# EAGLE design Lab6 (EAGLE 7.0.0)
Lab 6 Jonathan Valvano, system implementing Lab 3, 4 or 5 on the LM3S811.
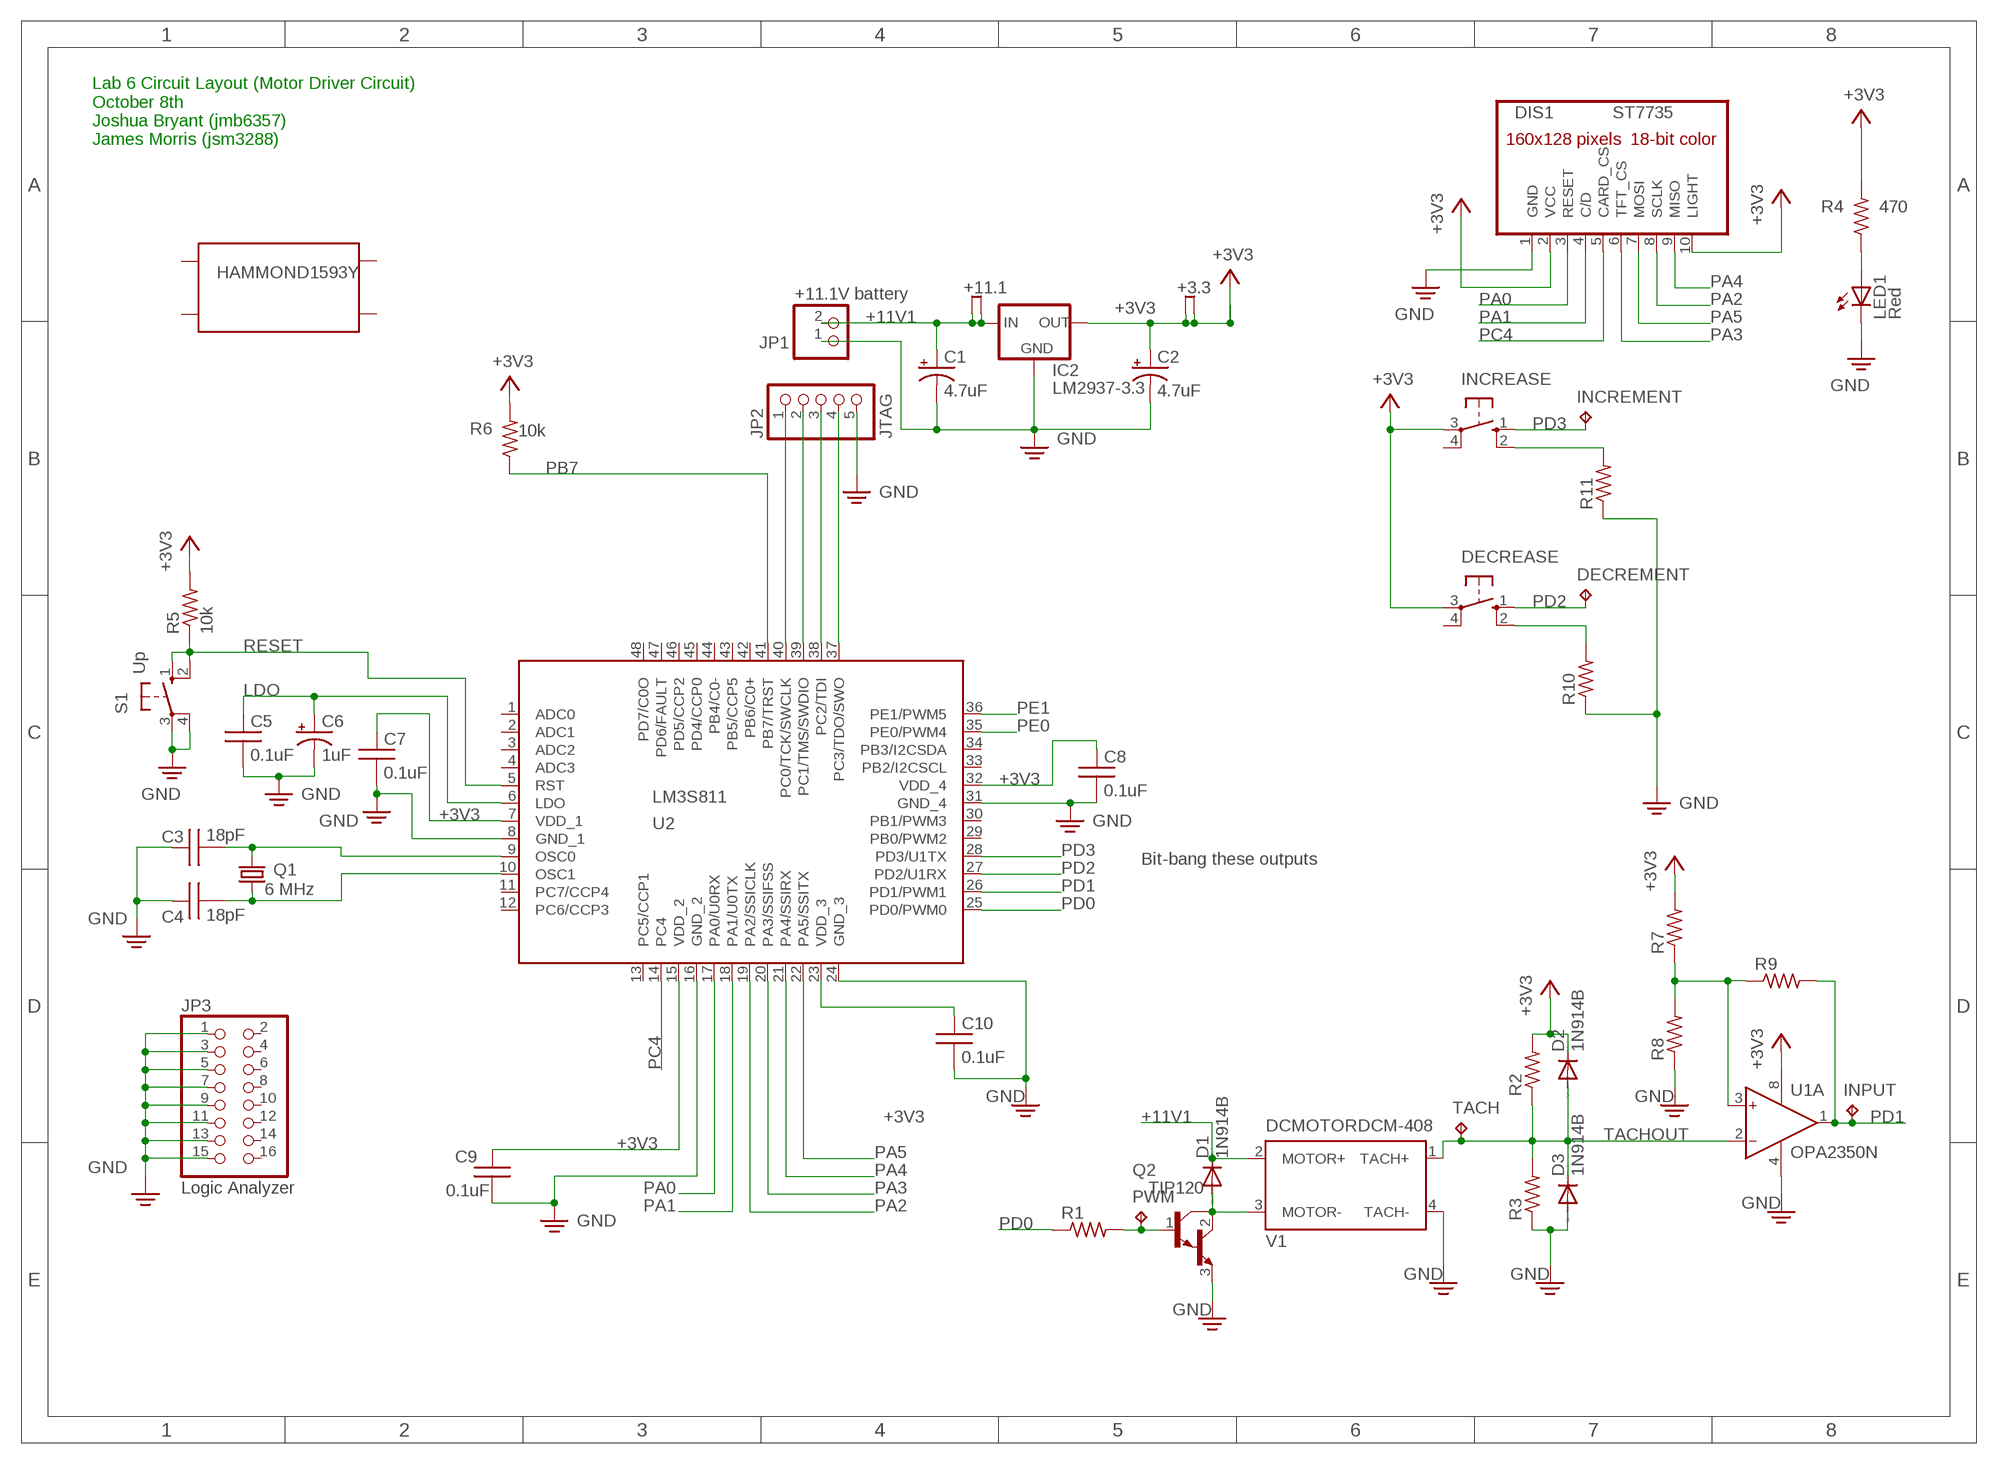
[diagram p0: schematic, sheet 1]

## Parts
+3.3  TP2  [TP2]
+11.1  TP2  [TP2]
C1  4.7uF  CAPACITOR_POLARIZEDE5-6  [CAP200MILPOLARIZED]
C2  4.7uF  CAPACITOR_POLARIZEDE5-6  [CAP200MILPOLARIZED]
C3  18pF  CAPACITOR025-024X044  [CAP100MIL]
C4  18pF  CAPACITOR025-024X044  [CAP100MIL]
C5  0.1uF  CAPACITOR025-024X044  [CAP100MIL]
C6  1uF  CAPACITOR_POLARIZEDE5-6  [CAP200MILPOLARIZED]
C7  0.1uF  CAPACITOR025-024X044  [CAP100MIL]
C8  0.1uF  CAPACITOR025-024X044  [CAP100MIL]
C9  0.1uF  CAPACITOR025-024X044  [CAP100MIL]
C10  0.1uF  CAPACITOR025-024X044  [CAP100MIL]
D1  1N914B  [DO35-7]
D2  1N914B  [DO35-7]
D3  1N914B  [DO35-7]
DECREASE  B3F-1052  [B3F-10XX]
DECREMENT  TP_KEYSTONE500X  [P1.1MM]
DIS1  ST7735  [ST7735]
IC2  LM2937-3.3  78XXS  [78XXS]
INCREASE  B3F-1052  [B3F-10XX]
INCREMENT  TP_KEYSTONE500X  [P1.1MM]
INPUT  TP_KEYSTONE500X  [P1.1MM]
JP1  +11.1V battery  PINHD-1X2  [1X02]
JP2  JTAG  PINHD-1X5  [1X05]
JP3  Logic Analyzer  PINHD-2X8/90  [2X08/90]
LED1  Red  LED5MM  [LED5MM]
PWM  TP_KEYSTONE500X  [P1.1MM]
Q1  6 MHz  CRYSTALHC49S  [HC49/S]
Q2  TIP120  [TO220]
R1  RESISTOR0204/7  [RES300MIL]
R2  RESISTOR0204/7  [RES300MIL]
R3  RESISTOR0204/7  [RES300MIL]
R4  470  RESISTOR0204/5  [RES200MIL]
R5  10k  RESISTOR0204/5  [RES200MIL]
R6  10k  RESISTOR0204/5  [RES200MIL]
R7  RESISTOR0204/7  [RES300MIL]
R8  RESISTOR0204/7  [RES300MIL]
R9  RESISTOR0204/7  [RES300MIL]
R10  RESISTOR0204/7  [RES300MIL]
R11  RESISTOR0204/7  [RES300MIL]
S1  Up  B3F-1052  [B3F-10XX]
TACH  TP_KEYSTONE500X  [P1.1MM]
U1  OPA2350N  [DIL08]
U2  LM3S811  [LQFP48-7X7]
U$1  HAMMOND1593Y  [HAMMOND1593Y]
V1  DCMOTORDCM-408  [DCMOTOR]

## Nets
+3V3: +3.3.MP1(TPB) +3.3.MP(TPA) C2.+ C7.1 C8.1 C9.1 C10.1 D2.C DECREASE.3(P) DIS1.2(VCC) DIS1.10(LIGHT) IC2.OUT INCREASE.3(P) R2.2 R4.2 R5.2 R6.2 R7.2 U1.8(P:V+) U2.7(VDD_1) U2.15(VDD_2) U2.23(VDD_3) U2.32(VDD_4)
+11V1: +11.1.MP1(TPB) +11.1.MP(TPA) C1.+ D1.C IC2.IN JP1.2 V1.2(MOTOR+)
GND: C1.- C2.- C3.1 C4.1 C5.2 C6.- C7.2 C8.2 C9.2 C10.2 D3.A DIS1.1(GND) IC2.GND JP1.1 JP2.5 JP3.1 JP3.3 JP3.5 JP3.7 JP3.9 JP3.11 JP3.13 JP3.15 LED1.K(C) Q2.3(E) R3.1 R8.1 R10.1 R11.1 S1.3(P) S1.4(P1) U1.4(P:V-) U2.8(GND_1) U2.16(GND_2) U2.24(GND_3) U2.31(GND_4) V1.4(TACH-)
LDO: C5.1 C6.+ U2.6(LDO)
M-: D1.A Q2.2(C) V1.3(MOTOR-)
N$1: JP2.4 U2.37(PC3/TDO/SWO)
N$2: JP2.3 U2.38(PC2/TDI)
N$3: JP2.2 U2.39(PC1/TMS/SWDIO)
N$4: JP2.1 U2.40(PC0/TCK/SWCLK)
N$6: PWM.TP Q2.1(B) R1.2
N$8: INCREASE.2(S1) R11.2
N$10: DECREASE.2(S1) R10.2
N$15: R7.1 R8.2 R9.1 U1.3(A:IN+)
OSC0: C3.2 Q1.2 U2.9(OSC0)
OSC1: C4.2 Q1.1 U2.10(OSC1)
PA0: DIS1.3(RESET) U2.17(PA0/U0RX)
PA1: DIS1.4(C/D) U2.18(PA1/U0TX)
PA2: DIS1.8(SCLK) U2.19(PA2/SSICLK)
PA3: DIS1.6(TFT_CS) U2.20(PA3/SSIFSS)
PA4: DIS1.9(MISO) U2.21(PA4/SSIRX)
PA5: DIS1.7(MOSI) U2.22(PA5/SSITX)
PB7: R6.1 U2.41(PB7/TRST)
PC4: DIS1.5(CARD_CS) U2.14(PC4)
PD0: R1.1 U2.25(PD0/PWM0)
PD1: INPUT.TP R9.2 U1.1(A:OUT) U2.26(PD1/PWM1)
PD2: DECREASE.1(S) DECREMENT.TP U2.27(PD2/U1RX)
PD3: INCREASE.1(S) INCREMENT.TP U2.28(PD3/U1TX)
PE0: U2.35(PE0/PWM4)
PE1: U2.36(PE1/PWM5)
RESET: R5.1 S1.1(S) S1.2(S1) U2.5(RST)
TACHOUT: D2.A D3.C R2.1 R3.2 TACH.TP U1.2(A:IN-) V1.1(TACH+)
VLED: LED1.A R4.1
Unconnected: DECREASE.4(P1) INCREASE.4(P1) JP3.2 JP3.4 JP3.6 JP3.8 JP3.10 JP3.12 JP3.14 JP3.16 U1.5(B:IN+) U1.6(B:IN-) U1.7(B:OUT) U2.1(ADC0) U2.2(ADC1) U2.3(ADC2) U2.4(ADC3) U2.11(PC7/CCP4) U2.12(PC6/CCP3) U2.13(PC5/CCP1) U2.29(PB0/PWM2) U2.30(PB1/PWM3) U2.33(PB2/I2CSCL) U2.34(PB3/I2CSDA) U2.42(PB6/C0+) U2.43(PB5/CCP5) U2.44(PB4/C0-) U2.45(PD4/CCP0) U2.46(PD5/CCP2) U2.47(PD6/FAULT) U2.48(PD7/C0O) U$1.1(H0) U$1.2(H1) U$1.3(H2) U$1.4(H3)

## Notes on the sheet
- Lab 6 Circuit Layout (Motor Driver Circuit)
  October 8th
  Joshua Bryant (jmb6357)
  James Morris (jsm3288)
- Bit-bang these outputs

## Library data of the parts
+3.3 +11.1 = EE445L:TP2: Low-cost test point Made with two 0.8mm holes.
C1 C2 C6 = EE445L:CAPACITOR_POLARIZED: POLARIZED CAPACITOR, American symbol
C3-C5 C7-C10 = EE445L:CAPACITOR: CAPACITOR, American symbol
D1-D3 = EE445L:1N914: DIODE high speed (Philips) 1N914
DECREASE INCREASE S1 = EE445L:B3F-1052: OMRON SWITCH 1.1mm holes; MPN: B3F-1000; OC_FARNELL: 176432; OC_NEWARK: 36M3542
DECREMENT INCREMENT INPUT PWM TACH = EE445L:TP: Test pad Test point, black, Keystone Electronics 5001, Digikey 5001K-ND Test point, orange, Keystone Electronics 5003, Digikey 5003K-ND Test point, yellow, Keystone Electronics 5004, Digikey 5004K-ND Test point, white, Keystone Electronics 5002, Digikey 5002K-ND Test point, red, Keystone Electronics 5000, Digikey 5000K-ND
DIS1 = EE445L:ST7735: Sitronix ST7735R 18-bit color, 1.8" TFT LCD display, 128*160, http://www.adafruit.com/products/358 // Backlight (pin 10) connected to +3.3 V // MISO (pin 9) PA4 (SSI0Rx) // SCK (pin 8) connected to PA2 (SSI0Clk) // MOSI (pin 7) connected to PA5 (SSI0Tx) // TFT_CS (pin 6) connected to PA3 (SSI0Fss) // CARD_CS (pin 5) connected to PD7 GPIO output(for SDC) // Data/Command (pin 4) connected to PA6 (GPIO), high for data, low for command // RESET (pin 3) connected to PA7 (GPIO) // VCC (pin 2) connected to +3.3 V // Gnd (pin 1) connected to ground; OC_FARNELL: unknown; OC_NEWARK: unknown
IC2 = EE445L:78XXS: VOLTAGE REGULATOR 7805, 78M05, LM2937-5.0, LM2937-3.3
JP1 = EE445L:PINHD-1X2: PIN HEADER
JP2 = EE445L:PINHD-1X5: PIN HEADER
JP3 = EE445L:PINHD-2X8: PIN HEADER
LED1 = EE445L:LED: Avago Technologies LED Green 2mA 5mm diffused, HLMP-4740, Digikey 516-1327-ND Red 1.6V 1mA 5mm diffused, HLMP-D150, Digikey 516-1323-ND Yellow 2mA 5mm diffused, HLMP-4719, Digikey 516-1326-ND Orange 10mA 5mm diffused HLMP-D401, Digikey 516-1330-ND Blue 10mA 5mm diffused
Q1 = EE445L:CRYSTAL: CRYSTAL HC49/US; OC_FARNELL: 1667008; OC_NEWARK: unknown
Q2 = EE445L:TIP120: NPN Darlington Transistor
R1-R11 = EE445L:RESISTOR: RESISTOR, American symbol
U1 = EE445L:OPA2350: 2.7V to 5.5V Rail-to-Rail I/O Dual Amplifier High-Speed 38MHz, Single-Supply, slew rate 22V/us, 500uV offset, 4uV noise; OC_FARNELL: unknown; OC_NEWARK: unknown
U2 = EE445L:LM3S811: LM3S811-IQN50-C28k RAM,64k Flash,32 I/O pins, 50 MHz, Cortex M3 PA0 – PA1 U0RX, U0TX Universal Asynchronous Receiver/Transmitter, UART0 PA2 – PA5 SCLK, SFSS, SRX, STX Synchronous Serial Interface, SSI0 PB0, PB1 PWM2, PWM3 Pulse Width Modulator 1 PB2 – PB3 SCL, SDA Inter-Integrated Circuit, I2C0 PB4, PB6, PD7 C0-, C0+, C0o Analog Comparator 0 PB5 CCP5 Timer2B Capture/Compare PB7, PC0 – PC3 TRST, TCLK, TMS, TDI, TDO JTAG Debugger PC5 CCP1 Timer 0B Capture/Compare PC6 CCP3 Timer 1B Capture/Compare PC7 CCP4 Timer 2A Capture/Compare PD0, PD1 PWM0, PWM1 Pulse Width Modulator 0 PD2 – PD3 U1RX, U1TX Universal Asynchronous Receiver/Transmitter, UART1 PD4 CCP0 Timer 0A Capture/Compare PD5 CCP2 Timer 1A Capture/Compare PD6 Fault Hold all PWM outputs in safe state PE0, PE1 PWM4, PWM5 Pulse Width Modulator 2 ADC3-ADC0 ADC 10 bit ADC; MFN: LM3S811-IQN50-C2
U$1 = EE445L:HAMMOND1593Y: Hammond 1593Y 5.5 by 2.6 by 1.1 box PCB for this box, with drill holes Newark 95B0648 $ 5.90 (element14) Mouser 1593YBK $ 4.80 Digi-Key HM862-ND $4.82
V1 = EE445L:DCMOTOR: DC motor DC motor with tachometer, www.allelectronics.com CAT# DCM-408. The two wires located near the shaft are the brushed DC motor, and the two wires going under the plastic cap are the tachometer. Pin 1, yellow, motor+ Pin 2, red, tach + Pin 3, blue, tach - Pin 4, green, motor -; OC_FARNELL: unknown; OC_NEWARK: unknown

## Board
Lab 6 Jonathan Valvano, system implementing Lab 3, 4 or 5 on the LM3S811.
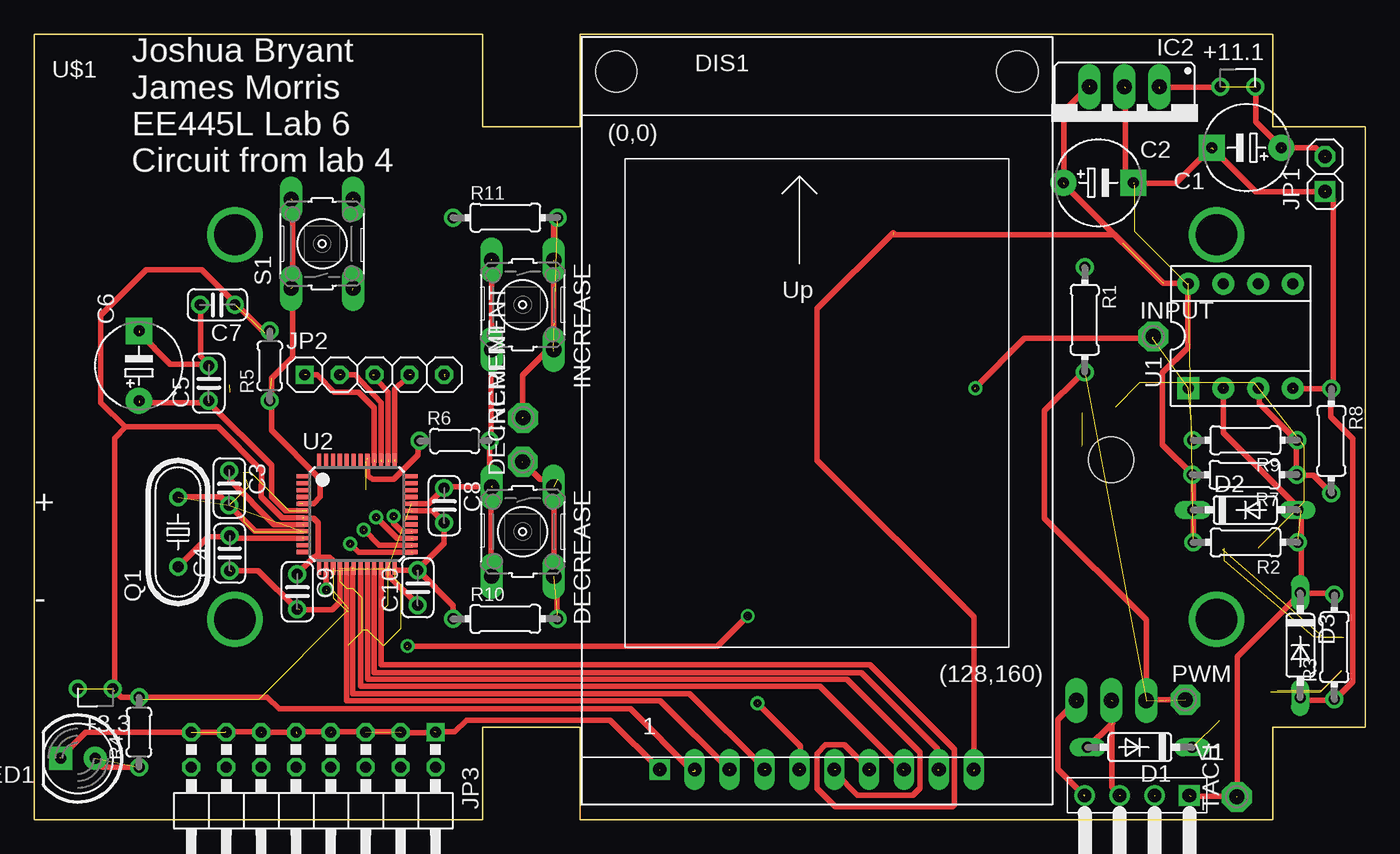
[diagram p1: board, top side]
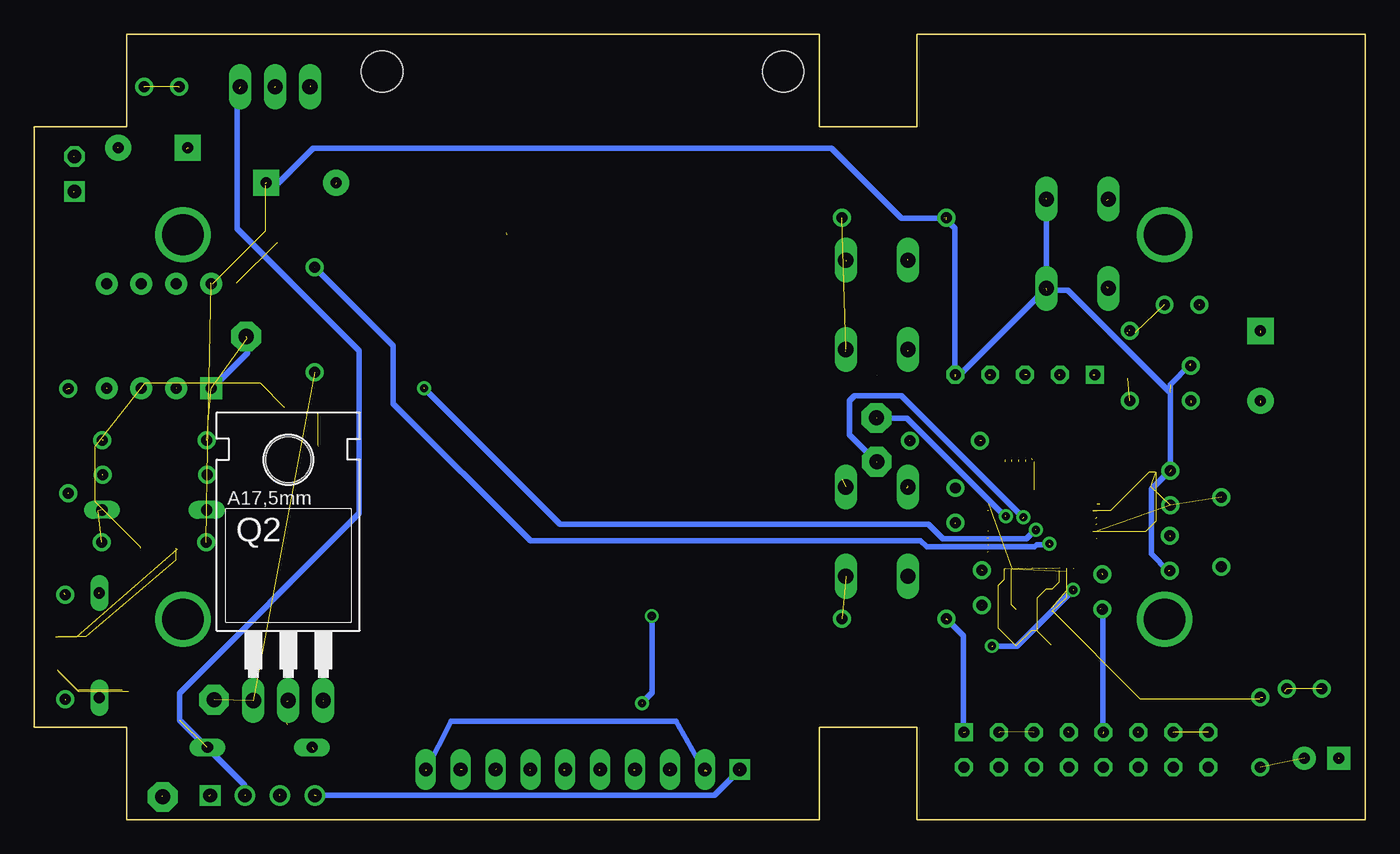
[diagram p2: board, bottom side, seen from below]

Size 96.9 x 57.15 mm. Coordinates in mm from the lower left corner, seen from the top.
Copper layers (1*16): Top 0.035mm / dielectric 1.5mm / Bottom 0.035mm
Design rules "default *": minimum track width 10mil, minimum drill 0.8mm, track to track 8mil, track to pad 8mil, pad to pad 8mil, via to via 8mil, smd to smd 8mil, copper to edge 40mil, drill to drill 8mil, minimum pad ring 10mil, minimum via ring 8mil, stop-mask expansion 4mil, vias tented up to drill 0mil, thermal gap 10mil

### Footprints (pad centres in the part's own frame; a part is rotated, then mirrored left to right if it is on the bottom)
TP2 = drill 0.8: MP 0,0; MP1 2.54,0
CAP200MILPOLARIZED = drill 0.8 pad 1.905: + -2.54,0 | drill 0.8 pad 1.905 square: - 2.54,0
CAP100MIL = drill 0.8: 1 -1.27,0; 2 1.27,0
DO35-7 = drill 0.813 long: A 3.81,0; C -3.81,0
B3F-10XX = drill 1.1 long: 1 -3.251,2.261; 2 3.251,2.261; 3 -3.251,-2.261; 4 3.251,-2.261
P1.1MM = drill 1.1 pad 2.159 octagon: TP 0,0
ST7735 = drill 1 square: 1 -10.16,-30.48 | drill 1 long: 2 -7.62,-30.48; 3 -5.08,-30.48; 4 -2.54,-30.48; 5 0,-30.48; 6 2.54,-30.48; 7 5.08,-30.48; 8 7.62,-30.48; 9 10.16,-30.48; 10 12.7,-30.48 | hole 3: -13.335,20.32; 15.875,20.32
78XXS = drill 1.1 long: GND 0,-2.54; IN -2.54,-2.54; OUT 2.54,-2.54
1X02 = drill 1 square: 1 -1.27,0 | drill 1 octagon: 2 1.27,0
1X05 = drill 0.8 square: 1 -5.08,0 | drill 0.8 octagon: 2 -2.54,0; 3 0,0; 4 2.54,0; 5 5.08,0
2X08/90 = drill 0.8 square: 1 -8.89,-6.35 | drill 0.8 octagon: 2 -8.89,-3.81; 3 -6.35,-6.35; 4 -6.35,-3.81; 5 -3.81,-6.35; 6 -3.81,-3.81; 7 -1.27,-6.35; 8 -1.27,-3.81; 9 1.27,-6.35; 10 1.27,-3.81; 11 3.81,-6.35; 12 3.81,-3.81; 13 6.35,-6.35; 14 6.35,-3.81; 15 8.89,-6.35; 16 8.89,-3.81
LED5MM = drill 0.8 pad 1.676: A -1.27,0 | drill 0.8 pad 1.676 square: K 1.27,0
HC49/S = drill 0.8: 1 -2.54,0; 2 2.54,0
TO220 = drill 1.1 long: 1 -2.54,-6.35; 2 0,-6.35; 3 2.54,-6.35 | hole 3.302: 0,11.176
RES300MIL = drill 0.8: 1 -3.81,0; 2 3.81,0
RES200MIL = drill 0.8: 1 -2.54,0; 2 2.54,0
DIL08 = drill 0.8 pad 1.6 square: 1 -3.81,-3.81 | drill 0.8 pad 1.6: 2 -1.27,-3.81; 3 1.27,-3.81; 4 3.81,-3.81; 5 3.81,3.81; 6 1.27,3.81; 7 -1.27,3.81; 8 -3.81,3.81
LQFP48-7X7 = smd 0.9 x 0.3: 1 -3.95,2.75; 2 -3.95,2.25; 3 -3.95,1.75; 4 -3.95,1.25; 5 -3.95,0.75; 6 -3.95,0.25; 7 -3.95,-0.25; 8 -3.95,-0.75; 9 -3.95,-1.25; 10 -3.95,-1.75; 11 -3.95,-2.25; 12 -3.95,-2.75; 25 3.95,-2.75; 26 3.95,-2.25; 27 3.95,-1.75; 28 3.95,-1.25; 29 3.95,-0.75; 30 3.95,-0.25; 31 3.95,0.25; 32 3.95,0.75; 33 3.95,1.25; 34 3.95,1.75; 35 3.95,2.25; 36 3.95,2.75 | smd 0.3 x 0.9: 13 -2.75,-3.95; 14 -2.25,-3.95; 15 -1.75,-3.95; 16 -1.25,-3.95; 17 -0.75,-3.95; 18 -0.25,-3.95; 19 0.25,-3.95; 20 0.75,-3.95; 21 1.25,-3.95; 22 1.75,-3.95; 23 2.25,-3.95; 24 2.75,-3.95; 37 2.75,3.95; 38 2.25,3.95; 39 1.75,3.95; 40 1.25,3.95; 41 0.75,3.95; 42 0.25,3.95; 43 -0.25,3.95; 44 -0.75,3.95; 45 -1.25,3.95; 46 -1.75,3.95; 47 -2.25,3.95; 48 -2.75,3.95
HAMMOND1593Y = drill 3: 1 -33.655,13.995; 2 -33.655,-13.995; 3 37.821,-13.995; 4 37.821,13.995
DCMOTOR = drill 1 square: 1 -3.81,0 | drill 1: 2 -1.27,0; 3 1.27,0; 4 3.81,0

### Placement (x,y rotation side)
+3.3  5.71,9.53 180 top
+11.1  86.36,53.34 0 top
C1  88.26,48.89 180 top
C2  77.47,46.36 0 top
C3  14.2,24.13 270 top
C4  14.22,19.38 90 top
C5  12.7,31.75 90 top
C6  7.62,33.02 90 top
C7  13.33,37.47 180 top
C8  29.84,22.86 270 top
C9  19.15,16.59 270 top
C10  27.91,16.87 90 top
D1  80.49,5.26 180 top
D2  88.16,22.53 0 top
D3  92.18,12.67 270 top
DECREASE  35.56,20.96 270 top
DECREMENT  35.56,26.04 90 top
DIS1  55.7,34.11 0 top
IC2  79.38,50.8 180 top
INCREASE  35.56,37.47 270 top
INCREMENT  35.59,29.24 90 top
INPUT  81.48,35.15 0 top
JP1  93.98,46.99 90 top
JP2  24.76,32.39 0 top
JP3  20.32,0 180 top
LED1  3.17,4.45 180 top
PWM  83.82,8.71 0 top
Q1  10.46,20.93 90 top
Q2  78.41,15.01 0 bottom
R1  76.48,36.37 270 top
R2  88.19,20.17 180 top
R3  94.67,12.55 90 top
R4  7.62,6.35 90 top
R5  17.14,33.02 90 top
R6  30.61,27.56 0 top
R7  88.11,25.1 180 top
R8  94.44,27.56 270 top
R9  88.16,27.61 180 top
R10  34.29,14.61 0 top
R11  34.29,43.81 0 top
S1  20.95,41.91 90 top
TACH  87.55,1.65 90 top
U1  87.83,35.2 0 top
U2  23.49,22.23 0 top
U$1  48.26,28.57 0 top
V1  80.29,1.75 180 top

### Tracks (layer width: path | path; a pad name or v marks a point on that pad's centre or on a via)
+3V3  (34 unrouted)
  Top 0.406: U2.32 28.69,22.98 C8.1 29.92,24.21 DECREASE.3 | 84.05,39.04 82.19,39.04 74.98,46.25 74.98,51.54 76.84,53.39 | 62.51,42.57 78.64,42.57 79.22,41.99 | 62.53,42.7 57,37.16 57,26.16 68.4,14.76 68.4,3.56 | 47.93,3.53 43.41,8.05 17.83,8.05 16.97,8.92 7.44,8.92 | 27.89,15.6 27.89,15.67 25.76,17.78 25.76,18.21 25.73,18.26 | 19.15,17.83 19.15,17.88 20.34,19.08 21.51,19.08 21.74,18.87 21.74,18.06 | 33.35,24.16 33.27,24.08 33.27,17.58 | 33.32,24.31 33.15,24.49 33.15,27.61 33.27,27.74 33.27,34.16 | 5.74,9.47 6.32,8.89 7.52,8.89 | U2.7 18.03,21.97 16.51,23.5 16.53,25.4 13.39,28.57 6.65,28.57 | 6.65,28.57 6.6,28.57 4.83,30.35 4.83,36.7 8.13,40 12.19,40 16.76,35.43 17.27,35.43 | 5.84,9.35 5.84,27.76 6.65,28.57 | 33.3,40.79 33.3,34.14 | 17.35,35.43 17.17,35.61 17.09,35.61 | 19.66,21.95 20.32,21.95 20.65,21.61 20.65,19.36 19.18,17.88
  Bottom 0.406: 48.11,3.51 50.19,7.16 66.57,7.16 68.38,3.58
+11V1  (9 unrouted)
  Top 0.406: 81.91,53.31 86.36,53.31 | 88.95,53.29 88.95,50.78 90.83,48.89 93.32,48.89 93.98,48.23
  Bottom 0.406: 81.97,53.19 82.14,53.01 82.14,43 73.25,34.11 73.25,22.28 86.34,9.2 86.34,7.24 81.59,2.49 81.59,1.73
GND  (57 unrouted)
  Top 0.406: 91.67,31.37 94.34,31.37 94.41,31.29 94.41,29.31 96.01,27.71 96.01,10.03 94.67,8.69 92.35,8.69 D3.A | C9.2 19.3,15.32 | C10.2 26.34,18.14 26.26,18.21 | 94.56,31.27 94.56,45.16 94.03,45.7 88.95,45.7 85.85,48.79 | 79.45,53.26 79.45,46.91 80.06,46.3 83.11,46.3 85.67,48.87 | 75.87,8.61 74.52,7.26 74.52,3.66 76.45,1.73 | 45.54,3.61 41.91,7.24 31.47,7.24 30.61,6.38 29.11,6.38 29.06,6.33 26.67,6.33 26.59,6.4 21.67,6.4 21.64,6.38 19.05,6.38 19.02,6.35 16.53,6.35 16.51,6.38 13.92,6.38 13.89,6.35 3.73,6.35 1.88,4.5 | 14.3,18.11 16.31,18.11 19.13,15.29 | 12.7,33.15 12.67,33.15 | 12.67,33.15 9.91,33.15 7.62,35.43 | 12.12,37.41 12.12,33.71 12.67,33.15 | 26.24,18.16 26.26,18.14 | 14.25,25.32 14.25,24.69 17.47,21.46 19.61,21.46 | 27.94,18.14 30.5,15.57 30.5,14.55 | 27.84,18.11 29.84,20.12 29.84,21.61 | 29.87,21.59 28.98,22.48 27.51,22.48
  Bottom 0.406: 76.38,1.75 47.37,1.75 45.54,3.58 | 14.15,25.45 15.57,24.03 15.57,19.33 14.33,18.09 | 12.75,33.1 14.2,31.65 14.2,25.35 | 30.4,14.55 29.23,13.39 29.23,6.35 | 30.48,43.64 29.87,43.03 29.87,32.23 | 23.22,45.21 23.22,38.68 29.51,32.39 29.9,32.39 | 29.84,21.87 29.84,21.51 | 19.25,15.34 19.1,15.19 19.1,6.25 | 23.16,38.53 21.64,38.53 14.22,31.11 | 30.68,43.76 33.76,43.76 38.86,48.87 76.61,48.87 79.15,46.33 80.11,46.33
LDO  (3 unrouted)
  Top 0.406: 7.62,30.35 12.7,30.35 17.27,25.78 17.27,23.5 18.29,22.48 19.81,22.48
M-  (4 unrouted)
  Top 0.406: 78.51,8.61 78.51,7.06 76.58,5.13 | 78.46,6.88 78.46,2.39 79.07,1.78
N$1  (2 unrouted)
  Top 0.406: 27.43,32.39 26.24,31.37 26.24,26.04
N$2  (2 unrouted)
  Top 0.406: 24.64,32.39 25.76,31.11 25.76,26.04
N$3  (2 unrouted)
  Top 0.406: 22.35,32.39 23.37,32.39 25.25,30.35 25.25,26.04
N$4  (2 unrouted)
  Top 0.406: 19.81,32.39 20.57,32.39 21.84,31.11 23.62,31.11 24.74,29.97 24.74,26.04
N$6  (2 unrouted)
  Top 0.406: 76.3,32.49 73.56,29.74 73.56,21.95 80.95,14.55 Q2.1 81,8.71 PWM.TP
N$7
  Top 0.406: 19.2,15.27 21.67,15.27 22.25,15.85 22.25,18.24
N$8  (1 unrouted)
N$9
  Bottom 0.406: 83.95,31.39 81.38,33.96 81.38,35.15
N$10  (1 unrouted)
N$12  (1 unrouted)
N$15  (5 unrouted)
  Top 0.406: 89.2,31.32 89.2,30.3 91.9,27.61 91.9,25.15 91.95,25.1 | 91.92,25.04 93.12,25.04 94.39,23.77
N$17  (2 unrouted)
N$21  (9 unrouted)
N$23  (2 unrouted)
N$24  (4 unrouted)
N$25  (2 unrouted)
N$26
  Top 0.406: 37.85,17.68 38.07,17.45 38.07,14.61
N$28
  Top 0.406: 37.82,17.68 37.85,17.7 37.85,24.69
N$33
  Top 0.406: 4.44,4.34 4.98,3.81 7.57,3.81
N$35  (2 unrouted)
N$45  (2 unrouted)
N$46  (2 unrouted)
N$47  (6 unrouted)
N$48  (2 unrouted)
N$49  (2 unrouted)
N$50  (3 unrouted)
N$52
  Top 0.406: 76.35,32.51 76.48,32.51
N$54
  Top 0.406: 84.4,20.14 84.4,22.53
N$55
  Top 0.406: 84.38,22.5 84.38,25.04 82.14,27.28 82.14,32.51 83.97,34.34 83.97,39.01
N$56  (2 unrouted)
OSC0  (10 unrouted)
  Top 0.406: 10.67,23.5 13.56,23.5 C3.2 16.08,20.98 19.58,20.98
OSC1  (3 unrouted)
  Top 0.406: 10.46,18.42 12.65,20.6 14.22,20.6 14.35,20.47 U2.10
PA0  (2 unrouted)
  Top 0.406: 50.65,3.58 45.57,8.66 22.73,8.66 22.73,18.26
PA1  (2 unrouted)
  Top 0.406: 23.19,18.29 23.19,9.17 47.7,9.17 53.26,3.61
PA2  (2 unrouted)
  Top 0.406: 23.75,18.26 23.75,9.7 57.2,9.7 63.25,3.66
PA3  (2 unrouted)
  Top 0.406: 58.37,3.61 58.37,3.35 59.94,1.78 63.96,1.78 64.47,2.29 64.47,4.9 59.16,10.21 24.26,10.21 24.26,18.26
PA4  (2 unrouted)
  Top 0.406: 24.74,18.26 24.74,10.69 60.22,10.69 65.76,5.16 65.76,3.63
PA5  (2 unrouted)
  Top 0.406: 60.83,3.61 59,5.44 57.61,5.44 56.97,4.8 56.97,2.29 58.32,0.94 66.85,0.94 66.98,1.07 66.98,5.13 60.83,11.28 25.25,11.28 25.25,18.26
PB7  (2 unrouted)
  Top 0.406: 24.26,26.29 24.26,25.02 24.64,24.77 26.16,24.77 27.94,26.54 27.94,27.56
PC4  (via drill 0.6)  (7 unrouted)
  Top 0.406: v21.26,16.71 21.23,16.74 21.23,18.26 | 27.13,12.62 49.76,12.62 v51.94,14.81 51.97,14.83 | v52.65,8.46 55.78,5.33 55.78,3.63
  Bottom 0.406: 21.28,16.69 25.35,12.62 27.1,12.62 | 51.94,14.78 51.94,9.22 52.65,8.51
  other vias: 27.18,12.62
PD0  (via drill 0.6)  (4 unrouted)
  Top 0.406: 23.01,20.07 23.62,19.46 27.51,19.46
  Bottom 0.406: 22.96,20.02 23.9,20.02 24.08,19.84 31.93,19.84 32.38,20.3 60.78,20.3 70.76,30.28 70.76,34.49 76.48,40.21
  other vias: 22.99,20.07
PD1  (via drill 0.6)  (8 unrouted)
  Top 0.406: 24,21.08 25.12,19.96 27.48,19.96 | 81.41,35.03 72.09,35.03 68.5,31.45
  Bottom 0.406: 24,21.08 24.66,20.42 30.73,20.42 31.8,21.49 58.62,21.49 68.48,31.34
  other vias: 23.98,21.08 68.53,31.39
PD2  (via drill 0.6)  (5 unrouted)
  Top 0.406: DECREMENT.TP 36.83,24.77 38.1,24.77 | 24.94,21.95 26.42,20.47 27.53,20.47
  Bottom 0.406: 24.89,21.97 33.76,30.84 37.19,30.84 37.54,30.48 37.54,27.99 35.56,26.01
  other vias: 24.89,22
PD3  (via drill 0.6)  (7 unrouted)
  Top 0.406: INCREASE.1 37.82,34.11 | 35.53,32.33 37.29,34.09 37.85,34.09 | 38.15,43.71 37.79,43.36 37.79,40.64 | 35.56,32.33 35.56,29.26 | v26.16,22.07 26.16,21.57 26.75,20.98 27.46,20.98
  Bottom 0.406: 26.24,22.07 33.38,29.21 35.56,29.21
RESET  (4 unrouted)
  Top 0.406: 19.3,22.99 20.32,22.99 20.83,23.5 20.83,24.77 17.27,28.32 17.27,32.13 18.8,33.66 18.8,38.48 18.8,38.73 18.8,45.09
TACHOUT  (8 unrouted)
  Top 0.406: 92.25,16.43 92.25,22.48 86.59,28.14 86.59,31.45 | 84.2,1.68 87.6,1.68 87.6,11.86 92.2,16.46 94.72,16.46 94.74,16.43
VLED  (1 unrouted)

### Text on the board
tNames: + | -
_tsilk: Joshua Bryant / James Morris / EE445L Lab 6 / Circuit from lab 4